# EAGLE schematic speedy barebone (EAGLE 9.5.2)
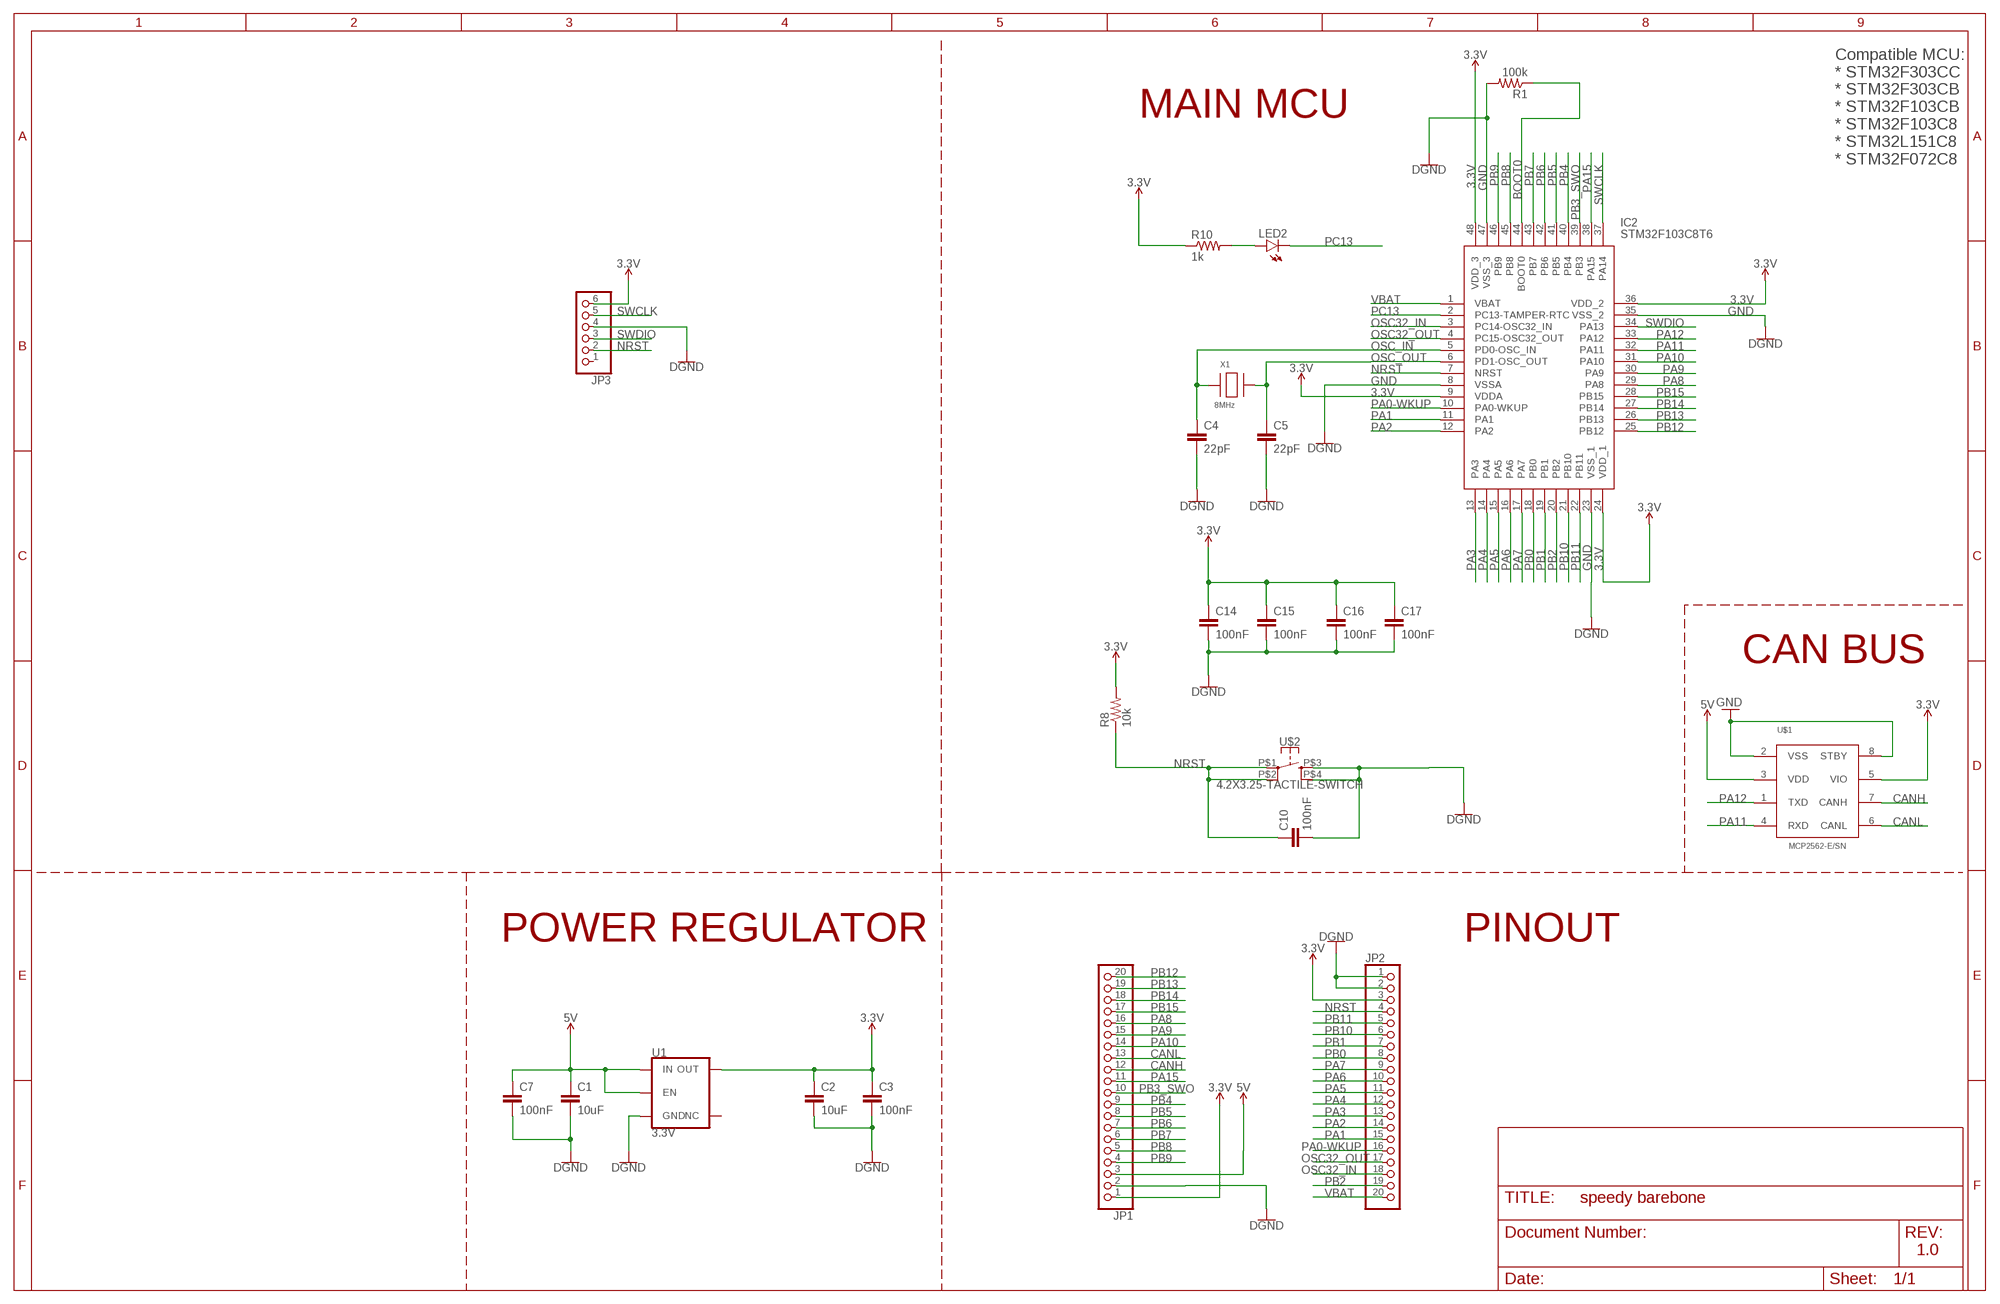
[diagram p0: schematic, sheet 1]

## Parts
C1  10uF  C-EUC0805  [C0805]
C2  10uF  C-EUC0805  [C0805]
C3  100nF  C-EUC0603  [C0603]
C4  22pF  C-EUC0603  [C0603]
C5  22pF  C-EUC0603  [C0603]
C7  100nF  C-EUC0603  [C0603]
C10  100nF  C-EUC0603  [C0603]
C14  100nF  C-EUC0603  [C0603]
C15  100nF  C-EUC0603  [C0603]
C16  100nF  C-EUC0603  [C0603]
C17  100nF  C-EUC0603  [C0603]
IC2  STM32F103C8T6  [QFP50P900X900X160-48N]
JP1  PINHD-1X20  [1X20]
JP2  PINHD-1X20  [1X20]
JP3  PINHD-1X6  [1X06]
LED2  LEDCHIP-LED0805  [CHIP-LED0805]
R1  100k  R-US_R0603  [R0603]
R8  10k  R-US_R0603  [R0603]
R10  1k  R-US_R0603  [R0603]
U1  3.3V  V_REG_AP2112K-3.3V  [SOT23-5]
U$1  MCP2562-E/SN  [SOIC8]
U$2  4.2X3.25-TACTILE-SWITCH  [4.2X3.25]
X1  8MHz  XTALNX5032  [NX5032]

## Nets
3.3V: C2.1 C3.1 C14.1 C15.1 C16.1 C17.1 IC2.9(VDDA) IC2.24(VDD_1) IC2.36(VDD_2) IC2.48(VDD_3) JP1.1 JP2.3 JP3.6 R8.2 R10.1 U1.5(OUT) U$1.5(VIO)
5V: C1.1 C7.1 JP1.3 U1.1(IN) U1.3(EN) U$1.3(VDD)
BOOT0: IC2.44(BOOT0) R1.1
CANH: JP1.12 U$1.7(CANH)
CANL: JP1.13 U$1.6(CANL)
GND: C1.2 C2.2 C3.2 C4.2 C5.2 C7.2 C10.2 C14.2 C15.2 C16.2 C17.2 IC2.8(VSSA) IC2.23(VSS_1) IC2.35(VSS_2) IC2.47(VSS_3) JP1.2 JP2.1 JP2.2 JP3.4 R1.2 U1.2(GND) U$1.2(VSS) U$1.8(STBY) U$2.P$3 U$2.P$4 ; supply symbol labelled DGND
N$9: LED2.A R10.2
NRST: C10.1 IC2.7(NRST) JP2.4 JP3.2 R8.1 U$2.P$1 U$2.P$2
OSC32_IN: IC2.3(PC14-OSC32_IN) JP2.18
OSC32_OUT: IC2.4(PC15-OSC32_OUT) JP2.17
OSC_IN: C4.1 IC2.5(PD0-OSC_IN) X1.P$1
OSC_OUT: C5.1 IC2.6(PD1-OSC_OUT) X1.P$2
PA0-WKUP: IC2.10(PA0-WKUP) JP2.16
PA1: IC2.11(PA1) JP2.15
PA2: IC2.12(PA2) JP2.14
PA3: IC2.13(PA3) JP2.13
PA4: IC2.14(PA4) JP2.12
PA5: IC2.15(PA5) JP2.11
PA6: IC2.16(PA6) JP2.10
PA7: IC2.17(PA7) JP2.9
PA8: IC2.29(PA8) JP1.16
PA9: IC2.30(PA9) JP1.15
PA10: IC2.31(PA10) JP1.14
PA11: IC2.32(PA11) U$1.4(RXD)
PA12: IC2.33(PA12) U$1.1(TXD)
PA15: IC2.38(PA15) JP1.11
PB0: IC2.18(PB0) JP2.8
PB1: IC2.19(PB1) JP2.7
PB2: IC2.20(PB2) JP2.19
PB3_SWO: IC2.39(PB3) JP1.10
PB4: IC2.40(PB4) JP1.9
PB5: IC2.41(PB5) JP1.8
PB6: IC2.42(PB6) JP1.7
PB7: IC2.43(PB7) JP1.6
PB8: IC2.45(PB8) JP1.5
PB9: IC2.46(PB9) JP1.4
PB10: IC2.21(PB10) JP2.6
PB11: IC2.22(PB11) JP2.5
PB12: IC2.25(PB12) JP1.20
PB13: IC2.26(PB13) JP1.19
PB14: IC2.27(PB14) JP1.18
PB15: IC2.28(PB15) JP1.17
PC13: IC2.2(PC13-TAMPER-RTC) LED2.C
SWCLK: IC2.37(PA14) JP3.5
SWDIO: IC2.34(PA13) JP3.3
VBAT: IC2.1(VBAT) JP2.20
Unconnected: JP3.1 U1.4(NC)

## Notes on the sheet
- MAIN MCU
- Compatible MCU:
  * STM32F303CC
  * STM32F303CB
  * STM32F103CB
  * STM32F103C8
  * STM32L151C8
  * STM32F072C8
- CAN BUS
- POWER REGULATOR | PINOUT
- 1.0

## Library data of the parts
C1-C3 C7 C10 C14-C17 = rcl:C-EU: CAPACITOR, European symbol; SPICEPREFIX: C
C4 C5 = resistor:C-EU: CAPACITOR, European symbol
IC2 = LCSC:STM32F103C8T6: STM32F103C8T6, 32 bit ARM Cortex M3 Microcontroller 72MHz 64kb Flash, 20kb RAM, USB I2C SPI 48-Pin LQFP Source: Datasheet <http://www.mouser.com/datasheet/2/389/stm32f103c8-956229.pdf>; DESCRIPTION: STM32F103C8T6, 32 bit ARM Cortex M3 Microcontroller 72MHz 64kb Flash, 20kb RAM, USB I2C SPI 48-Pin LQFP; HEIGHT: 1.6mm; MANUFACTURER_NAME: STMicroelectronics; MANUFACTURER_PART_NUMBER: STM32F103C8T6; MOUSER_PART_NUMBER: 511-STM32F103C8T6
JP1 JP2 = pinhead:PINHD-1X20: PIN HEADER
JP3 = pinhead:PINHD-1X6: PIN HEADER
LED2 = led:LED: LED OSRAM: - CHIPLED LG R971, LG N971, LY N971, LG Q971, LY Q971, LO R971, LY R971 LH N974, LH R974 LS Q976, LO Q976, LY Q976 LO Q996 - Hyper CHIPLED LW Q18S LB Q993, LB Q99A, LB R99A - SideLED LS A670, LO A670, LY A670, LG A670, LP A670 LB A673, LV A673, LT A673, LW A673 LH A674 LY A675 LS A676, LA A676, LO A676, LY A676, LW A676 LS A679, LY A679, LG A679 - Hyper Micro SIDELED® LS Y876, LA Y876, LO Y876, LY Y876 LT Y87S - SmartLED LW L88C, LW L88S LB L89C, LB L89S, LG L890 LS L89K, LO L89K, LY L89K LS L896, LA L896, LO L896, LY L896 - TOPLED LS T670, LO T670, LY T670, LG T670, LP T670 LSG T670, LSP T670, LSY T670, LOP T670, LYG T670 LG T671, LOG T671, LSG T671 LB T673, LV T673, LT T673, LW T673 LH T674 LS T676, LA T676, LO T676, LY T676, LB T676, LH T676, LSB T676, LW T676 LB T67C, LV T67C, LT T67C, LS T67K, LO T67K, LY T67K, LW E67C LS E67B, LA E67B, LO E67B, LY E67B, LB E67C, LV E67C, LT E67C LW T67C LS T679, LY T679, LG T679 LS T770, LO T770, LY T770, LG T770, LP T770 LB T773, LV T773, LT T773, LW T773 LH T774 LS E675, LA E675, LY E675, LS T675 LS T776, LA T776, LO T776, LY T776, LB T776 LHGB T686 LT T68C, LB T68C - Hyper Mini TOPLED® LB M676 - Mini TOPLED Santana® LG M470 LS M47K, LO M47K, LY M47K Source: http://www.osram.convergy.de LUXEON: - LUMILED® LXK2-PW12-R00, LXK2-PW12-S00, LXK2-PW14-U00, LXK2-PW14-V00 LXK2-PM12-R00, LXK2-PM12-S00, LXK2-PM14-U00 LXK2-PE12-Q00, LXK2-PE12-R00, LXK2-PE12-S00, LXK2-PE14-T00, LXK2-PE14-U00 LXK2-PB12-K00, LXK2-PB12-L00, LXK2-PB12-M00, LXK2-PB14-N00, LXK2-PB14-P00, LXK2-PB14-Q00 LXK2-PR12-L00, LXK2-PR12-M00, LXK2-PR14-Q00, LXK2-PR14-R00 LXK2-PD12-Q00, LXK2-PD12-R00, LXK2-PD12-S00 LXK2-PH12-R00, LXK2-PH12-S00 LXK2-PL12-P00, LXK2-PL12-Q00, LXK2-PL12-R00 Source: www.luxeon.com KINGBRIGHT: KA-3528ASYC Source: www.kingbright.com
R1 R8 R10 = rcl:R-US_: RESISTOR, American symbol; SPICEPREFIX: R
U1 = SparkFun-IC-Power:V_REG_AP2112: AP2112 - 600mA CMOS LDO Regulator w/ Enable The AP2112 is CMOS process low dropout linear regulator with enable function, the regulator delivers a guaranteed 600mA (min.) continuous load current. Features Output Voltage Accuracy: ±1.5% Output Current: 600mA (Min.) Foldback Short Current Protection: 50mA Enable Function to Turn ON/OFF VOUT Low Dropout Voltage (3.3V): 250mV (Typ.) @IOUT=600mA Excellent Load Regulation: 0.2%/A (Typ.) Excellent Line Regulation: 0.02%/V (Typ.) Low Quiescent Current: 55μA (Typ.) Low Standby Current: 0.01μA (Typ.) Low Output Noise: 50μVRMS PSRR: 100Hz -65dB, 1kHz -65dB OTSD Protection Stable with 1.0μF Flexible Cap: Ceramic, Tantalum and Aluminum Electrolytic Operation Temperature Range: -40°C to 85°C ESD: MM 400V, HBM 4000V; PROD_ID: VREG-12457
U$1 = SPEAR:MCP2562-E/SN
U$2 = LCSC:4.2X3.25-TACTILE-SWITCH
X1 = adafruit:XTAL: Low cost SMT crystals, no capacitors included http://www.ladyada.net/library/eagle